# Altium schematic sheet Architecture.SchDoc
size A3; SheetNumber: 2; SheetTotal: 14
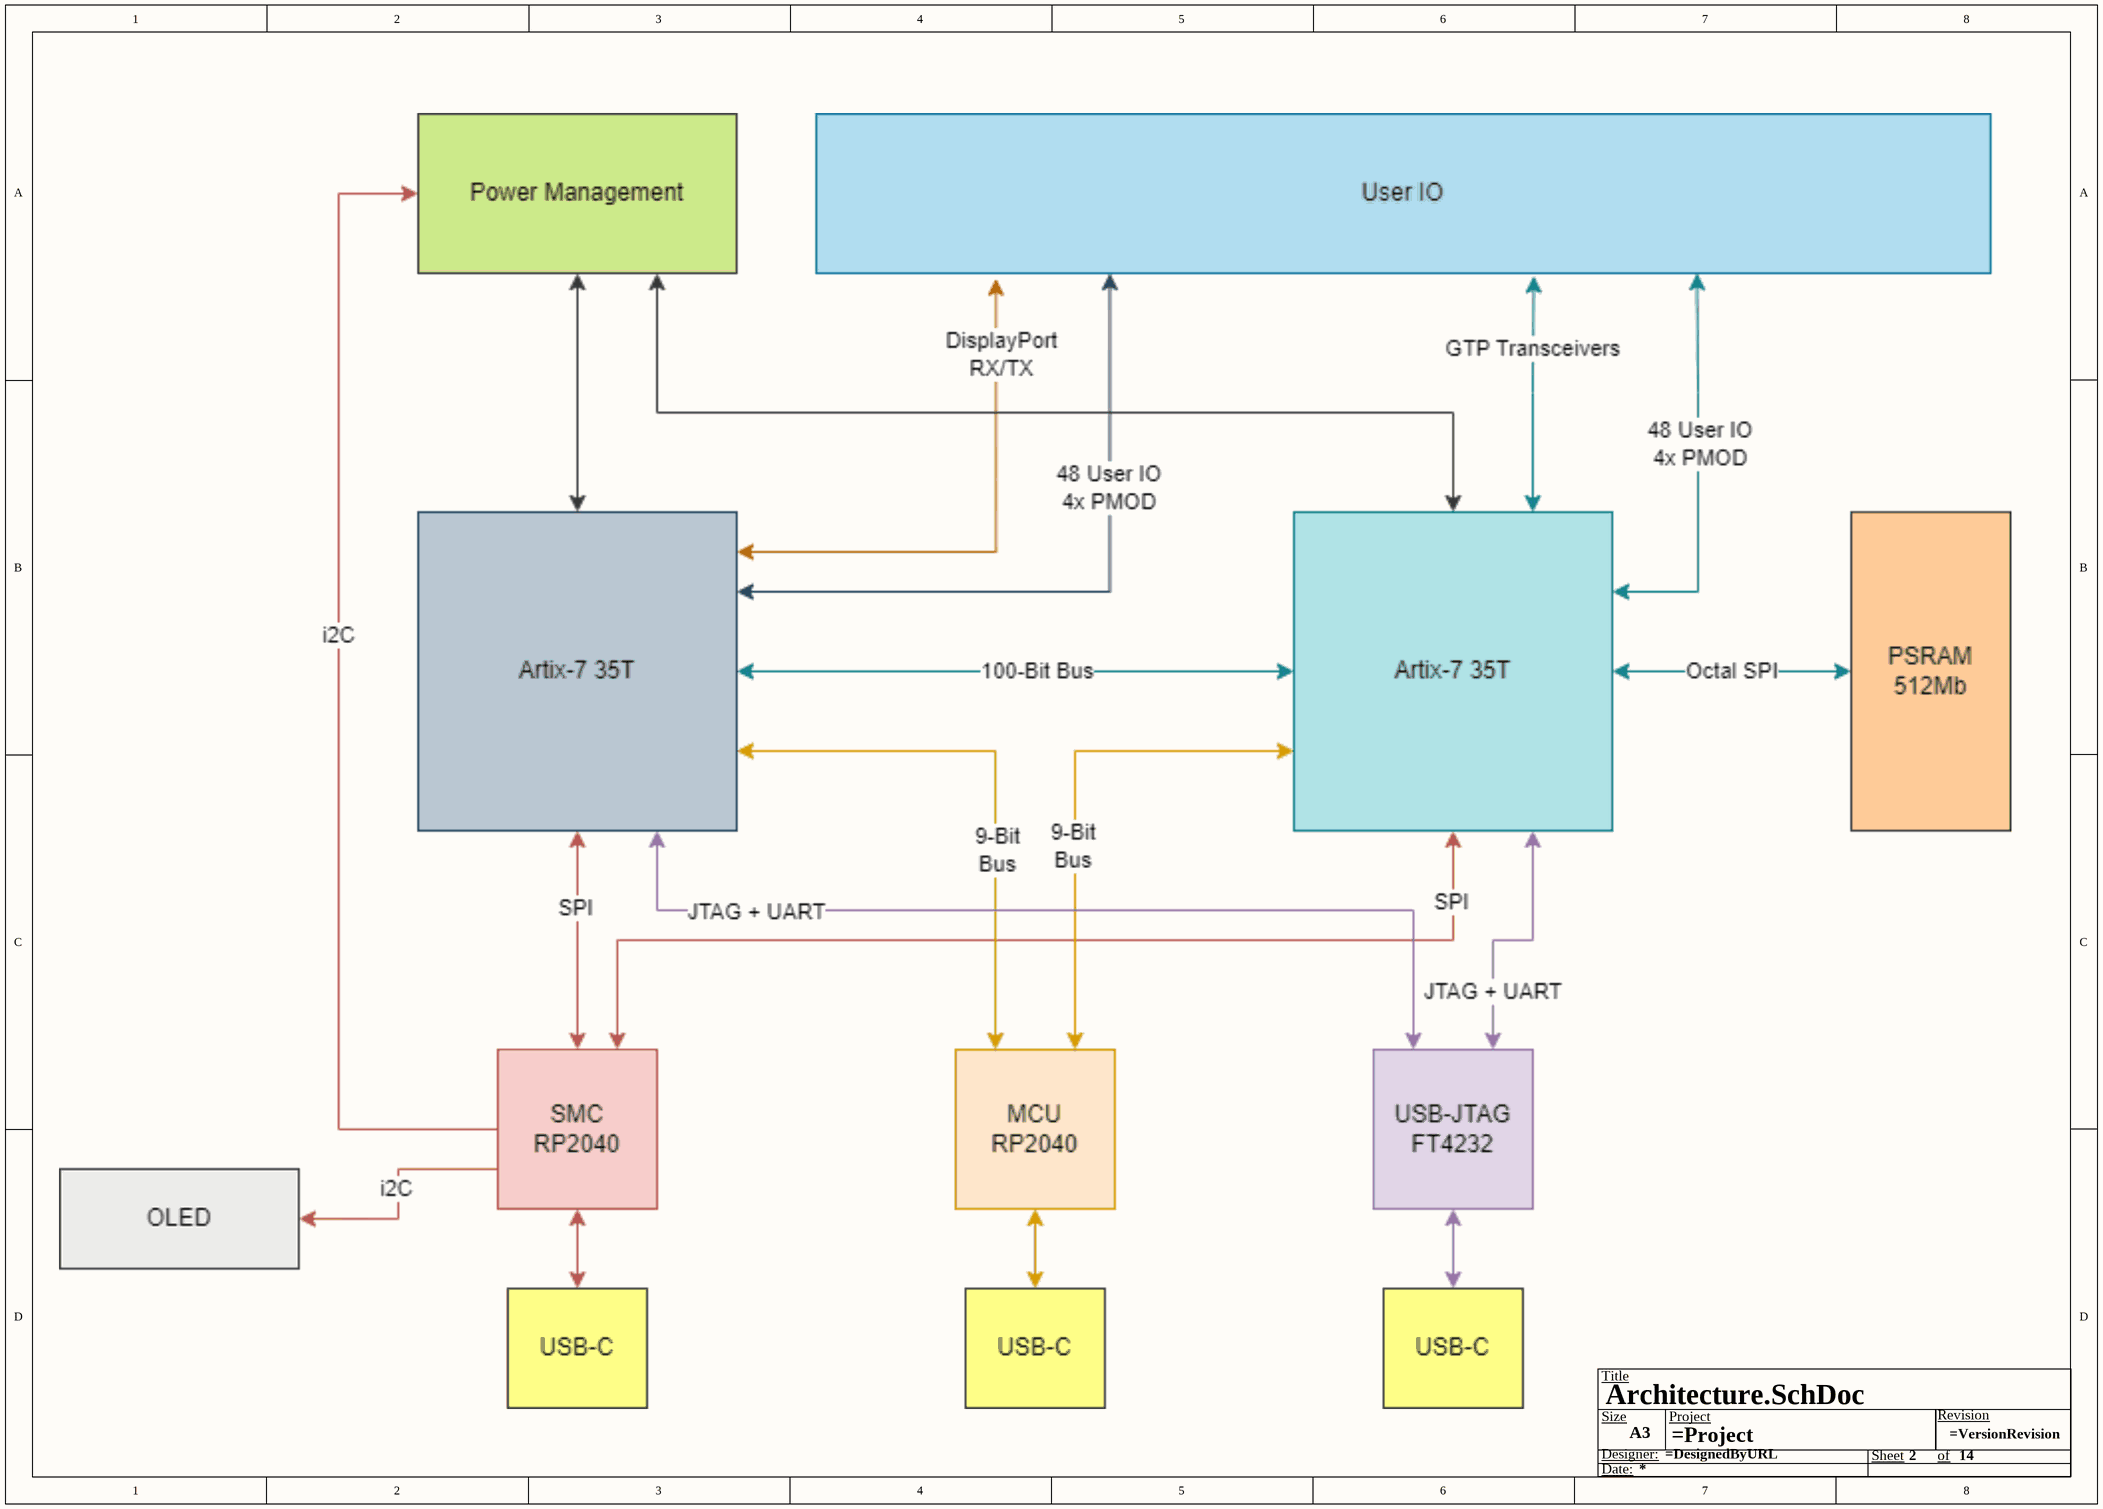
[diagram p0: Architecture.SchDoc]

## Parts
*  Size: A3  (hidden comment: Title Block)  (graphical)

## Notes on the sheet
- (in symbol CMP-007-000006-8) Title; Size; Project; Revision; Designer:; Sheet; of; Date:

## Library data of the parts
* = CMP-007-000006-8: Generic Title Block